# EAGLE design 4OR_1 (EAGLE 6.5.0)
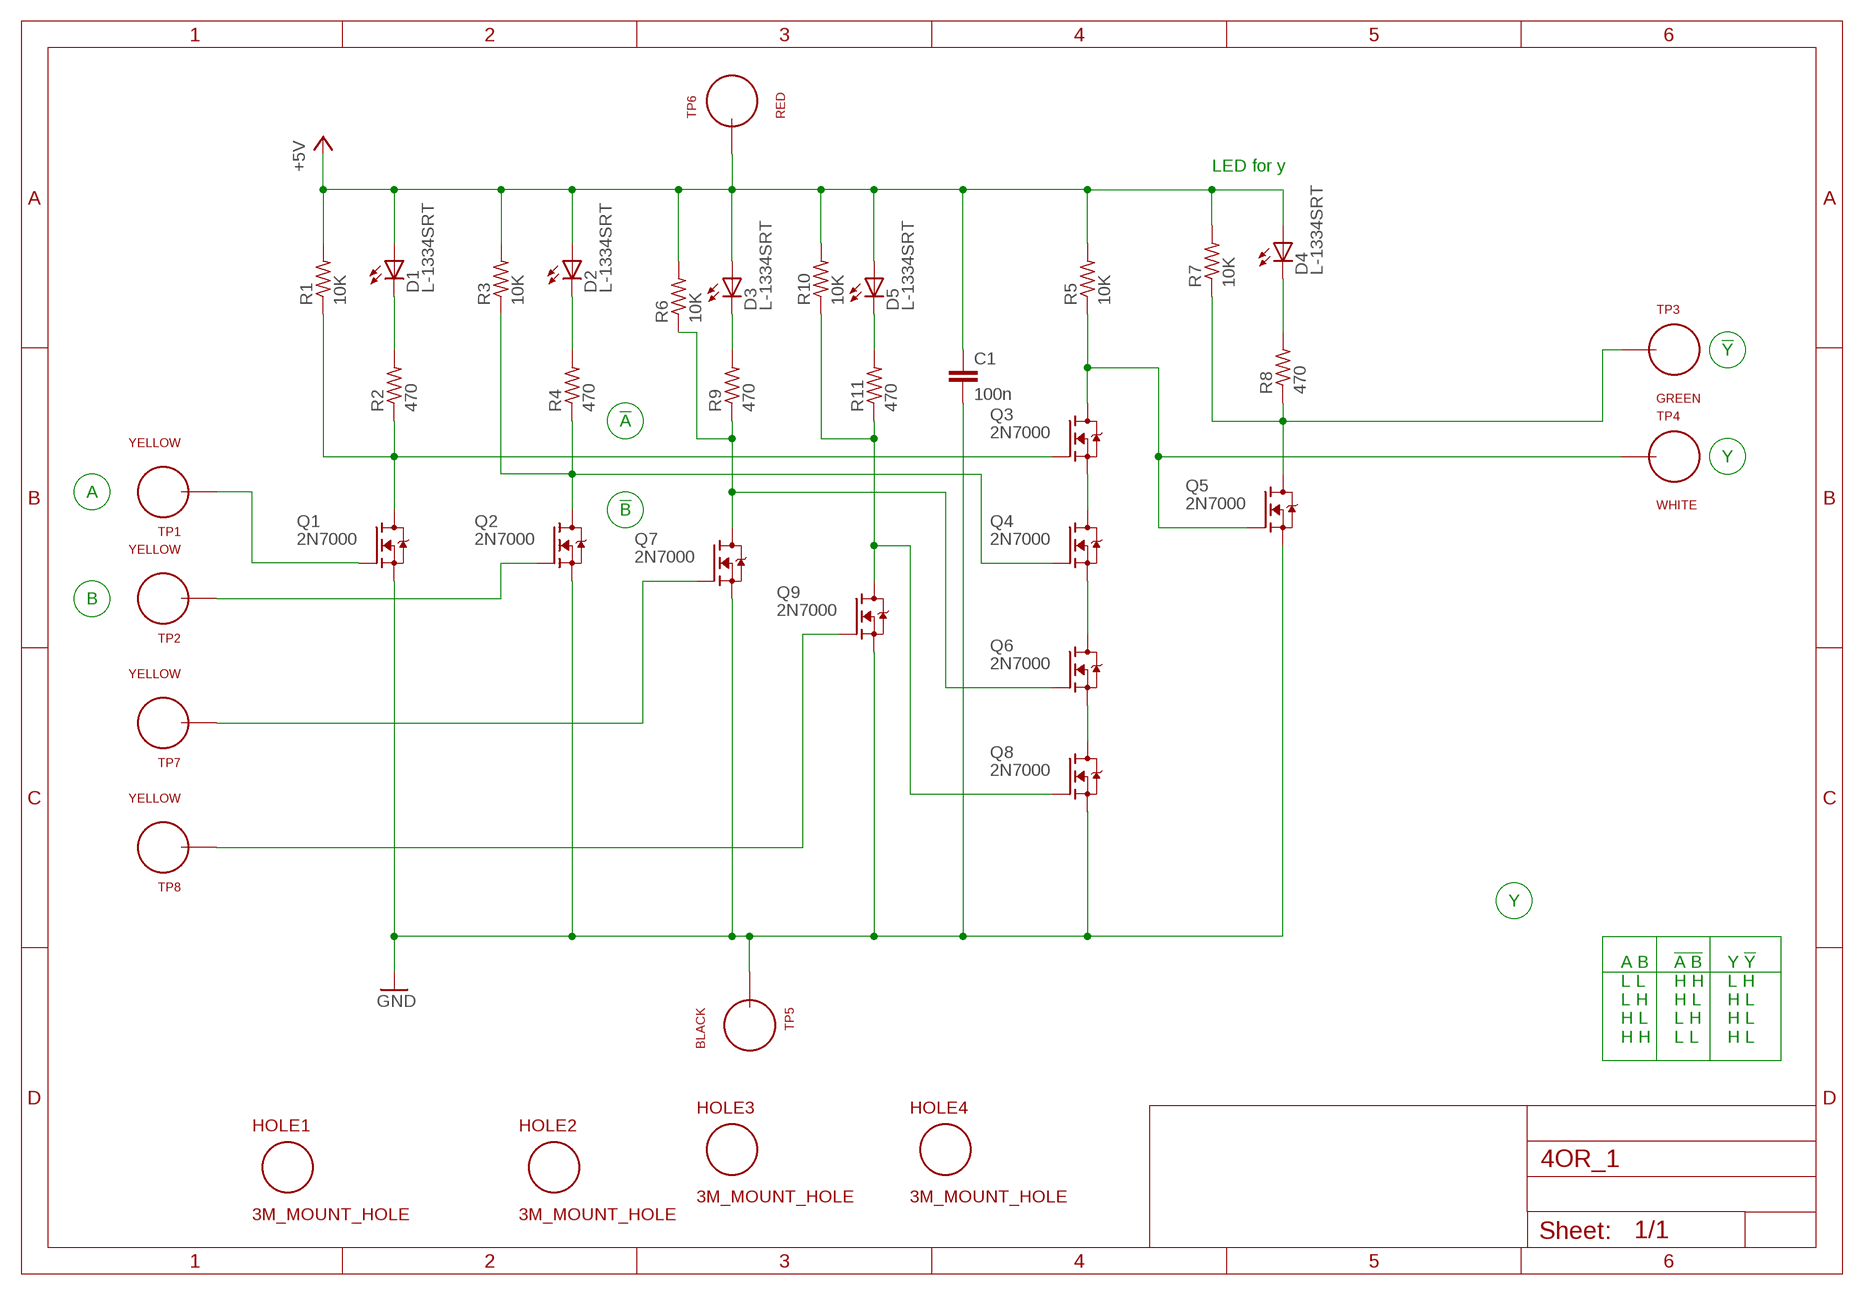
[diagram p0: schematic, sheet 1]

## Parts
C1  100n  C_P2INCH  [CAP_P2INCH]
D1  L-1334SRT  [LED3MM]
D2  L-1334SRT  [LED3MM]
D3  L-1334SRT  [LED3MM]
D4  L-1334SRT  [LED3MM]
D5  L-1334SRT  [LED3MM]
HOLE1  3M_MOUNT_HOLE  [3M_HOLE]
HOLE2  3M_MOUNT_HOLE  [3M_HOLE]
HOLE3  3M_MOUNT_HOLE  [3M_HOLE]
HOLE4  3M_MOUNT_HOLE  [3M_HOLE]
Q1  2N7000  [TO92-DGS]
Q2  2N7000  [TO92-DGS]
Q3  2N7000  [TO92-DGS]
Q4  2N7000  [TO92-DGS]
Q5  2N7000  [TO92-DGS]
Q6  2N7000  [TO92-DGS]
Q7  2N7000  [TO92-DGS]
Q8  2N7000  [TO92-DGS]
Q9  2N7000  [TO92-DGS]
R1  10K  R_P2INCH  [R_P2INCH]
R2  470  R_P2INCH  [R_P2INCH]
R3  10K  R_P2INCH  [R_P2INCH]
R4  470  R_P2INCH  [R_P2INCH]
R5  10K  R_P2INCH  [R_P2INCH]
R6  10K  R_P2INCH  [R_P2INCH]
R7  10K  R_P2INCH  [R_P2INCH]
R8  470  R_P2INCH  [R_P2INCH]
R9  470  R_P2INCH  [R_P2INCH]
R10  10K  R_P2INCH  [R_P2INCH]
R11  470  R_P2INCH  [R_P2INCH]
TP1  YELLOW  TEST_LOOP  [TEST_LOOP]
TP2  YELLOW  TEST_LOOP  [TEST_LOOP]
TP3  GREEN  TEST_LOOP  [TEST_LOOP]
TP4  WHITE  TEST_LOOP  [TEST_LOOP]
TP5  BLACK  TEST_LOOP  [TEST_LOOP]
TP6  RED  TEST_LOOP  [TEST_LOOP]
TP7  YELLOW  TEST_LOOP  [TEST_LOOP]
TP8  YELLOW  TEST_LOOP  [TEST_LOOP]

## Nets
+5V: C1.1 D1.A D2.A D3.A D4.A D5.A R1.2 R3.2 R5.2 R6.2 R7.2 R10.2 TP6.P$1
GND: C1.2 Q1.S Q2.S Q5.S Q7.S Q8.S Q9.S TP5.P$1
N$1: Q3.D Q5.G R5.1 TP4.P$1
N$2: Q3.S Q4.D
N$3: D4.K(C) R8.2
N$4: Q5.D R7.1 R8.1 TP3.P$1
N$5: Q4.S Q6.D
N$6: D2.K(C) R4.2
N$7: Q2.D Q4.G R3.1 R4.1
N$8: D1.K(C) R2.2
N$9: Q1.D Q3.G R1.1 R2.1
N$10: D3.K(C) R9.2
N$11: Q1.G TP1.P$1
N$12: Q2.G TP2.P$1
N$13: Q6.G Q7.D R6.1 R9.1
N$16: Q7.G TP7.P$1
N$17: Q6.S Q8.D
N$18: D5.K(C) R11.2
N$19: Q8.G Q9.D R10.1 R11.1
N$20: Q9.G TP8.P$1

## Notes on the sheet
- LED for y
- !Y
- !A
- Y
- A
- !B
- B
- Y
- A B
  L L
  L H
  H L
  H H
- !A B
  H H
  H L
  L H
  L L
- Y !Y
  L H
  H L
  H L
  H L

## Library data of the parts
C1 = MyLib:C_P2INCH
D1-D5 = MyLib:L-1334SRT
HOLE1-HOLE4 = MyLib:3M_MOUNT_HOLE
Q1-Q9 = MyLib:2N7000
R1-R11 = MyLib:R_P2INCH
TP1-TP8 = MyLib:TEST_LOOP

## Board
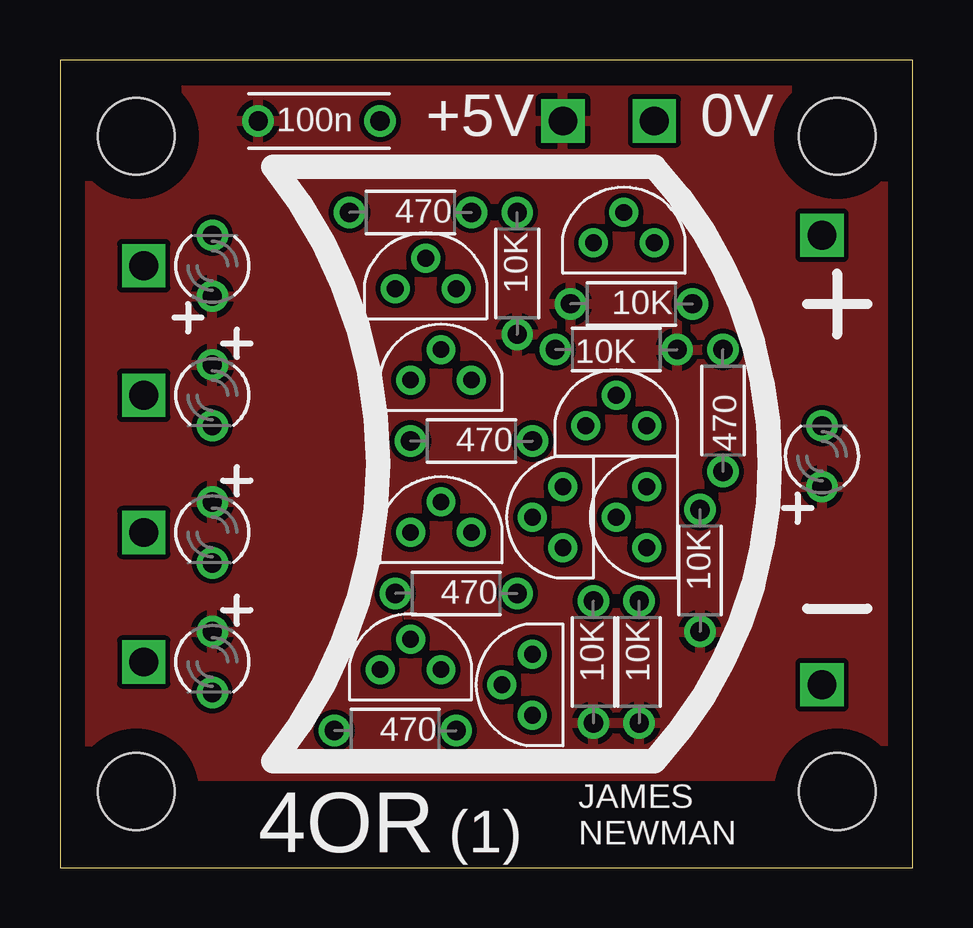
[diagram p1: board, top side]
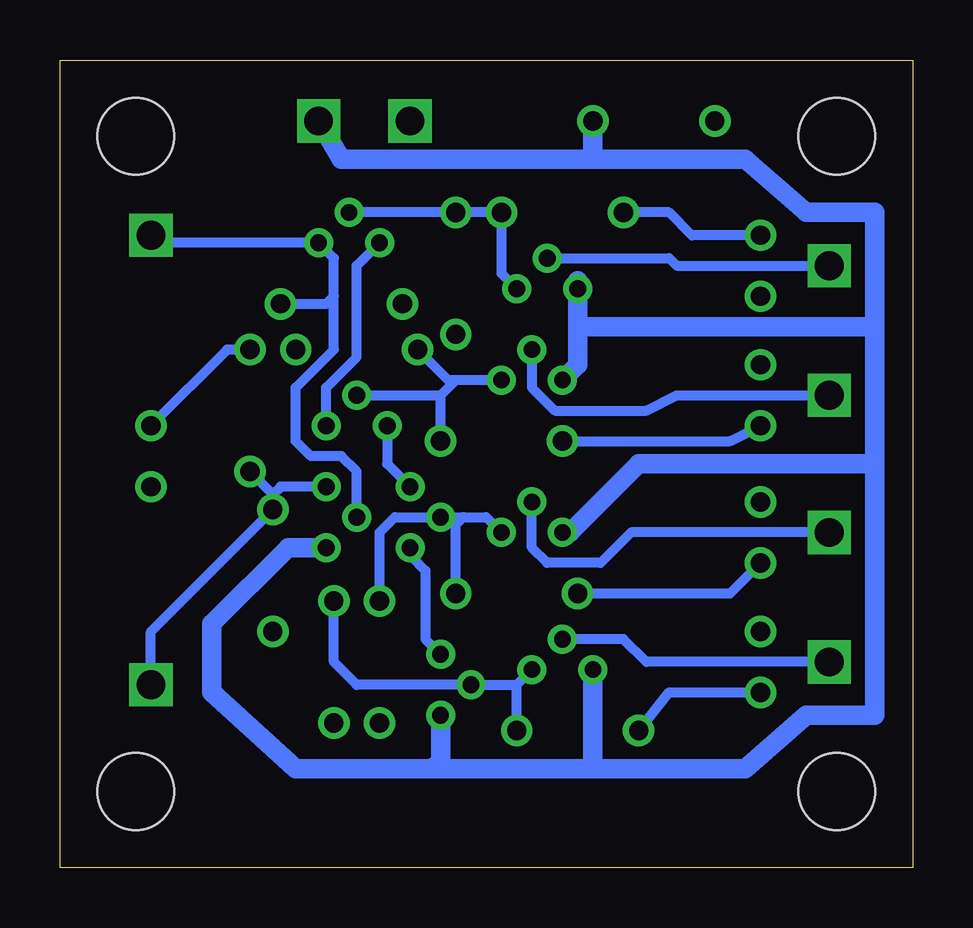
[diagram p2: board, bottom side, seen from below]

Size 35.54 x 33.66 mm. Coordinates in mm from the lower left corner, seen from the top.
Outline: 0,0 35.54,0 35.54,33.66 0,33.66 0,0
Copper layers (1*16): Top 0.035mm / dielectric 1.5mm / Bottom 0.035mm
Design rules "processor_rules *": minimum track width 10mil, minimum drill 0.0236mm, track to track 8mil, track to pad 8mil, pad to pad 8mil, via to via 8mil, smd to smd 8mil, copper to edge 40mil, drill to drill 8mil, minimum pad ring 10mil, minimum via ring 8mil, stop-mask expansion 4mil, vias tented up to drill 0.7mm, thermal gap 10mil

### Footprints (pad centres in the part's own frame; a part is rotated, then mirrored left to right if it is on the bottom)
CAP_P2INCH = drill 0.8: 1 -2.54,0; 2 2.54,0
LED3MM = drill 0.8: A -1.27,0; K 1.27,0
3M_HOLE = hole 3.2: 0,0
TO92-DGS = drill 0.7: D 0,1.27; G -1.27,0; S 0,-1.27
R_P2INCH = drill 0.8: 1 -2.54,0; 2 2.54,0
TEST_LOOP = drill 1.2 square: P$1 0,0

### Placement (x,y rotation side)
C1  10.79,31.11 0 top
D1  6.35,25.08 90 top
D2  6.35,19.68 270 top
D3  6.35,13.97 270 top
D4  31.75,17.14 90 top
D5  6.35,8.57 270 top
HOLE1  3.17,3.17 0 top
HOLE2  3.17,30.48 0 top
HOLE3  32.38,3.17 0 top
HOLE4  32.38,30.48 0 top
Q1  15.24,24.13 270 top
Q2  15.88,20.32 270 top
Q3  23.5,26.04 270 top
Q4  23.18,18.41 270 top
Q5  24.45,14.61 0 top
Q6  20.95,14.61 0 top
Q7  15.88,13.97 270 top
Q8  19.68,7.62 0 top
Q9  14.61,8.26 270 top
R1  19.05,24.77 270 top
R2  14.61,27.3 180 top
R3  23.18,21.59 0 top
R4  17.14,17.78 180 top
R5  23.81,23.5 180 top
R6  22.23,8.57 270 top
R7  26.67,12.38 270 top
R8  27.62,19.05 90 top
R9  16.51,11.43 180 top
R10  24.13,8.57 270 top
R11  13.97,5.71 180 top
TP1  3.49,25.08 0 top
TP2  3.49,19.68 0 top
TP3  31.75,7.62 0 top
TP4  31.75,26.35 0 top
TP5  24.77,31.11 0 top
TP6  20.95,31.11 0 top
TP7  3.49,13.97 0 top
TP8  3.49,8.57 0 top

### Tracks (layer width: path | path; a pad name or v marks a point on that pad's centre or on a via)
+5V
  pour Top: 1.27,32.38 34.29,32.38 34.29,3.81 1.27,3.81
GND
  Bottom 0.813: TP5.P$1 23.81,29.53 13.34,29.53 | 13.34,29.53 6.99,29.53 4.45,27.3 1.59,27.3 1.59,22.54 | 13.97,24.45 Q1.S 13.97,22.54 | Q2.S 13.97,20.95 13.97,22.54 | 13.97,22.54 1.59,22.54 | Q7.S 14.29,13.97 11.43,16.83 1.59,16.83 | Q9.S 13.34,4.13 | 13.34,4.13 20,4.13 | 20,4.13 25.72,4.13 29.21,7.3 29.21,10.16 26.04,13.34 Q5.S | 1.59,22.54 1.59,16.83 | 1.59,16.83 1.59,6.35 4.45,6.35 6.99,4.13 13.34,4.13 | Q8.S 19.68,4.45 20,4.13 | C1.2 13.34,29.53
N$1
  Bottom 0.406: TP4.P$1 31.43,26.04 Q3.D 24.13,25.4 24.13,23.81 | Q5.G 23.18,16.51 23.81,17.14 25.08,17.14 25.72,17.78 25.72,20 24.13,21.59 24.13,23.81 | R5.1 24.45,23.5 24.13,23.81
N$2
  Bottom 0.406: Q4.D 24.45,20 23.18,21.27 23.18,25.08 Q3.S
N$3
  Bottom 0.406: R8.2 28.57,21.59 D4.K
N$4
  Bottom 0.406: 26.67,15.56 R7.1 31.75,9.84 TP3.P$1 | 26.67,15.56 R8.1 | Q5.D 26.35,15.88 26.67,15.56
N$5
  Bottom 0.406: Q4.S 21.91,16.83 Q6.D
N$6
  Bottom 0.406: R4.2 7.62,17.78 D2.K
N$7
  Bottom 0.406: Q2.D 19.05,20.32 | 19.05,20.32 19.37,20.32 R3.1 | R4.1 19.68,19.68 | 19.68,19.68 19.05,20.32 | Q4.G 19.68,19.68
N$8
  Bottom 0.406: D1.K 9.21,26.35 10.16,27.3 R2.2
N$9
  Bottom 0.406: Q1.D 17.14,24.77 R2.1 R1.1 Q3.G
N$10
  Bottom 0.406: R9.2 7.62,11.43 D3.K
N$11
  Bottom 0.406: Q1.G 10.16,25.4 9.84,25.08 TP1.P$1
N$12
  Bottom 0.406: Q2.G 15.88,20 14.92,19.05 11.11,19.05 9.84,19.68 TP2.P$1
N$13
  Bottom 0.406: R6.1 22.23,13.97 21.59,14.61 Q6.G 18.73,14.61 | 18.73,14.61 17.78,14.61 Q7.D | R9.1 19.05,14.29 18.73,14.61
N$16
  Bottom 0.406: TP7.P$1 11.75,13.97 13.02,12.7 15.24,12.7 15.88,13.34 Q7.G
N$17
  Bottom 0.406: Q6.S 20.95,13.02 20.32,12.38 20.32,9.53 Q8.D
N$18
  Bottom 0.406: R11.2 10.16,7.3 D5.K
N$19
  Bottom 0.406: R10.1 24.13,8.57 23.18,7.62 Q8.G 16.51,7.62 | 16.51,7.62 Q9.D | R11.1 16.51,7.62
N$20
  Bottom 0.406: TP8.P$1 11.11,8.57 12.06,9.53 Q9.G

### Text on the board
tPlace: +5V | 0V | 4OR | (1) | JAMES / NEWMAN